# EAGLE schematic converter (EAGLE 8.2.2)
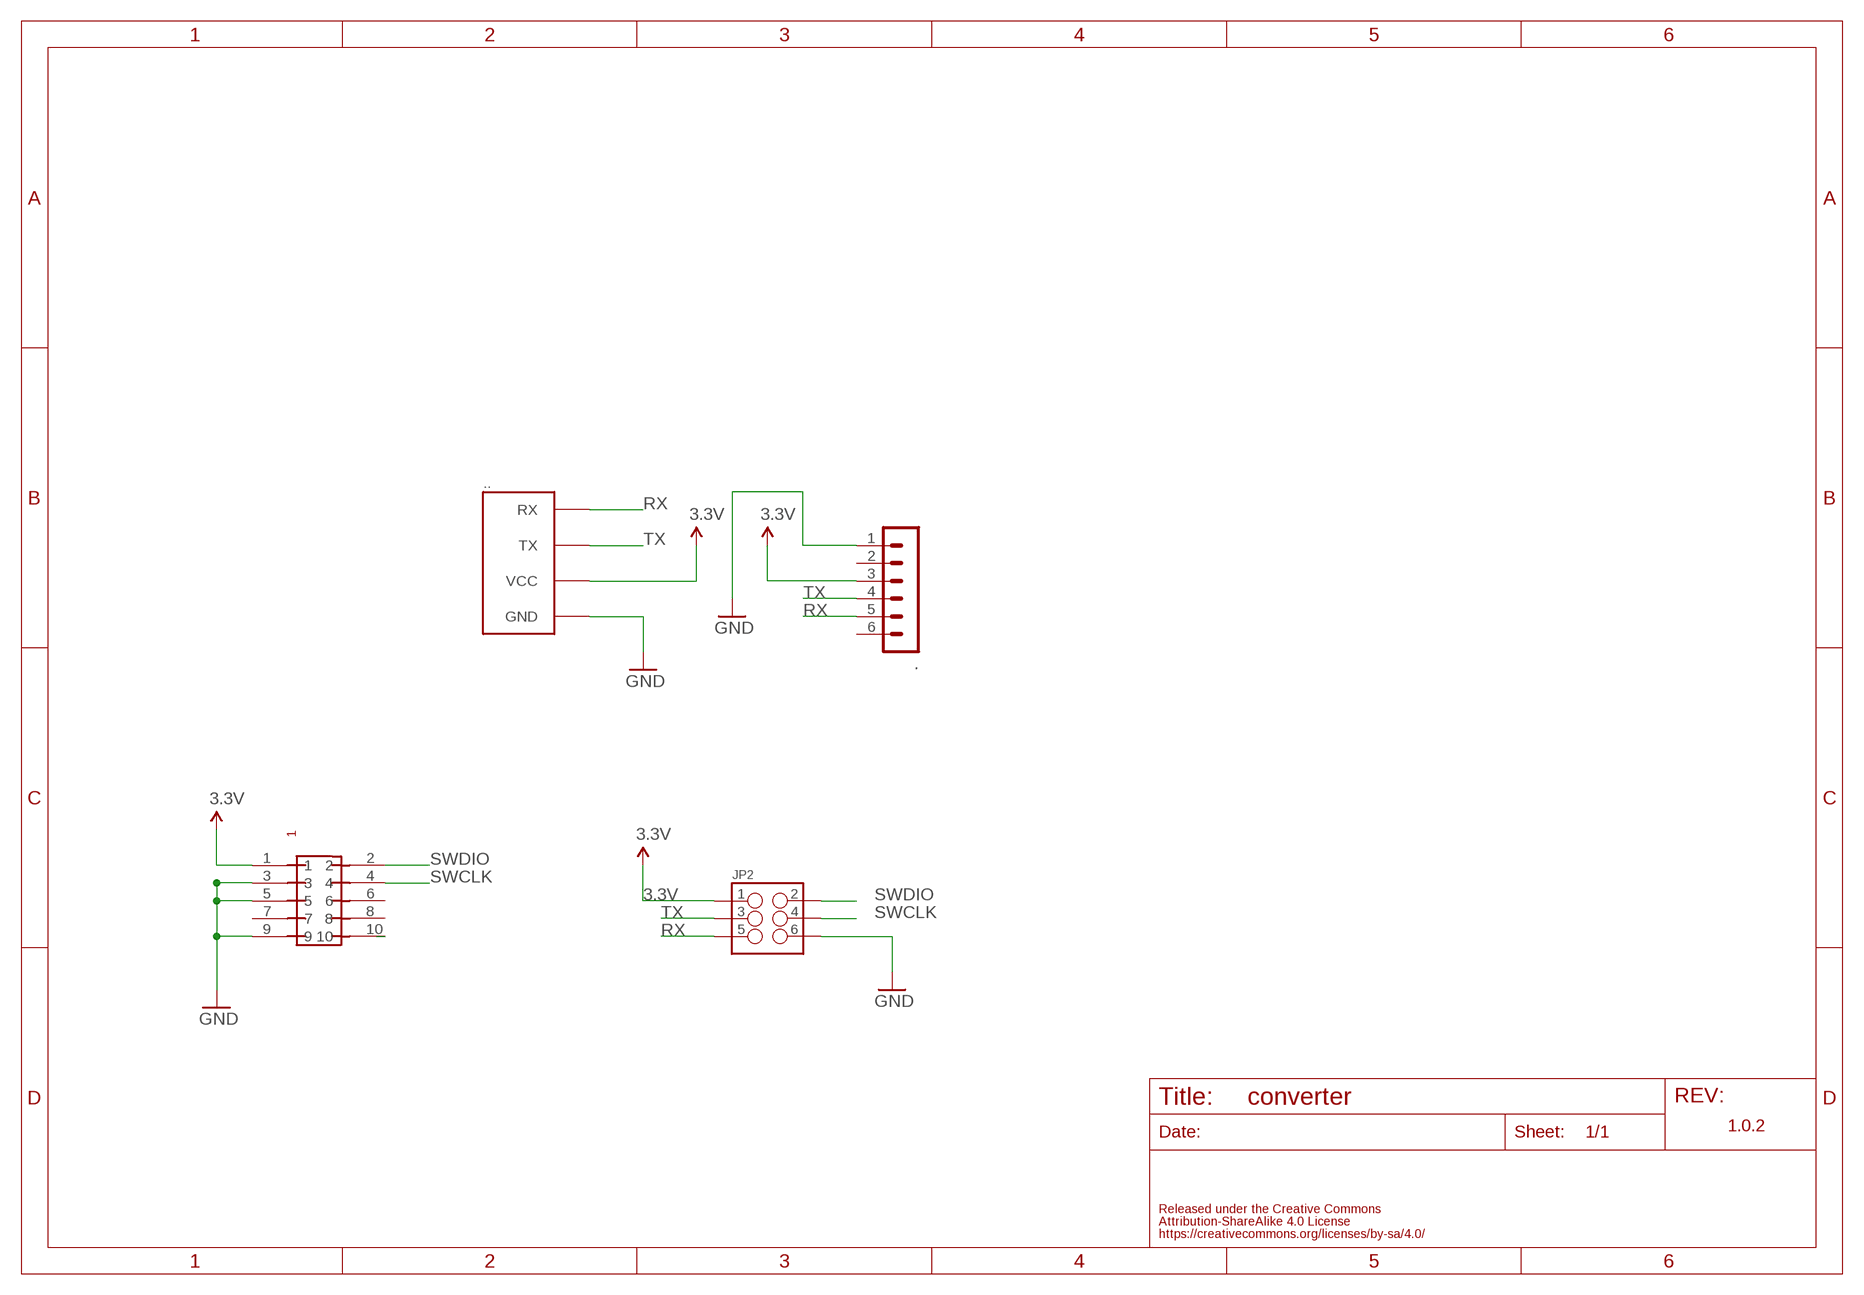
[diagram p0: schematic, sheet 1]

## Parts
.  MA06-1  [MA06-1]
..  FABO_BRICK_SERIAL-S04B-PASK-2  [FABO_BRICK_SERIAL_S04B-PASK-2]
JP2  M03X2  [2X3-SHROUDED]
U$5  PIN-HEADER-SMT(1.27MM)2X5  [PIN-HEADER-SMT(1.27MM)2X5]

## Nets
3.3V: ..3 ...VCC JP2.1 U$5.1
GND: ..1 ...GND JP2.6 U$5.3 U$5.5 U$5.9
RESET: U$5.10
RX: ..5 ...RX JP2.5
SWCLK: JP2.4 U$5.4
SWDIO: JP2.2 U$5.2
TX: ..4 ...TX JP2.3
Unconnected: ..2 ..6 U$5.6 U$5.7 U$5.8

## Notes on the sheet
- 1.0.2

## Library data of the parts
. = con-lstb:MA06-1: PIN HEADER; OC_FARNELL: unknown; OC_NEWARK: unknown
.. = FaBo-Template:FABO_BRICK_SERIAL: FaBo Brick Serial
JP2 = SparkFun-Connectors:M03X2: 2x3 .1" header. Shrouded, with keying- CONN-10681 SMT- CONN-11415 Pogo pins- HW-11044; PROD_ID: CONN-10681
U$5 = GClue:PIN-HEADER-SMT(1.27MM)2X5: PIN-HEADER-SMT (1.27MM) 2x5